# EAGLE schematic imu_68-v2 (EAGLE 9.6.2)
COMPANY: ADAFRUIT INDUSTRIES; DRAWN: KTOWN; REV: A
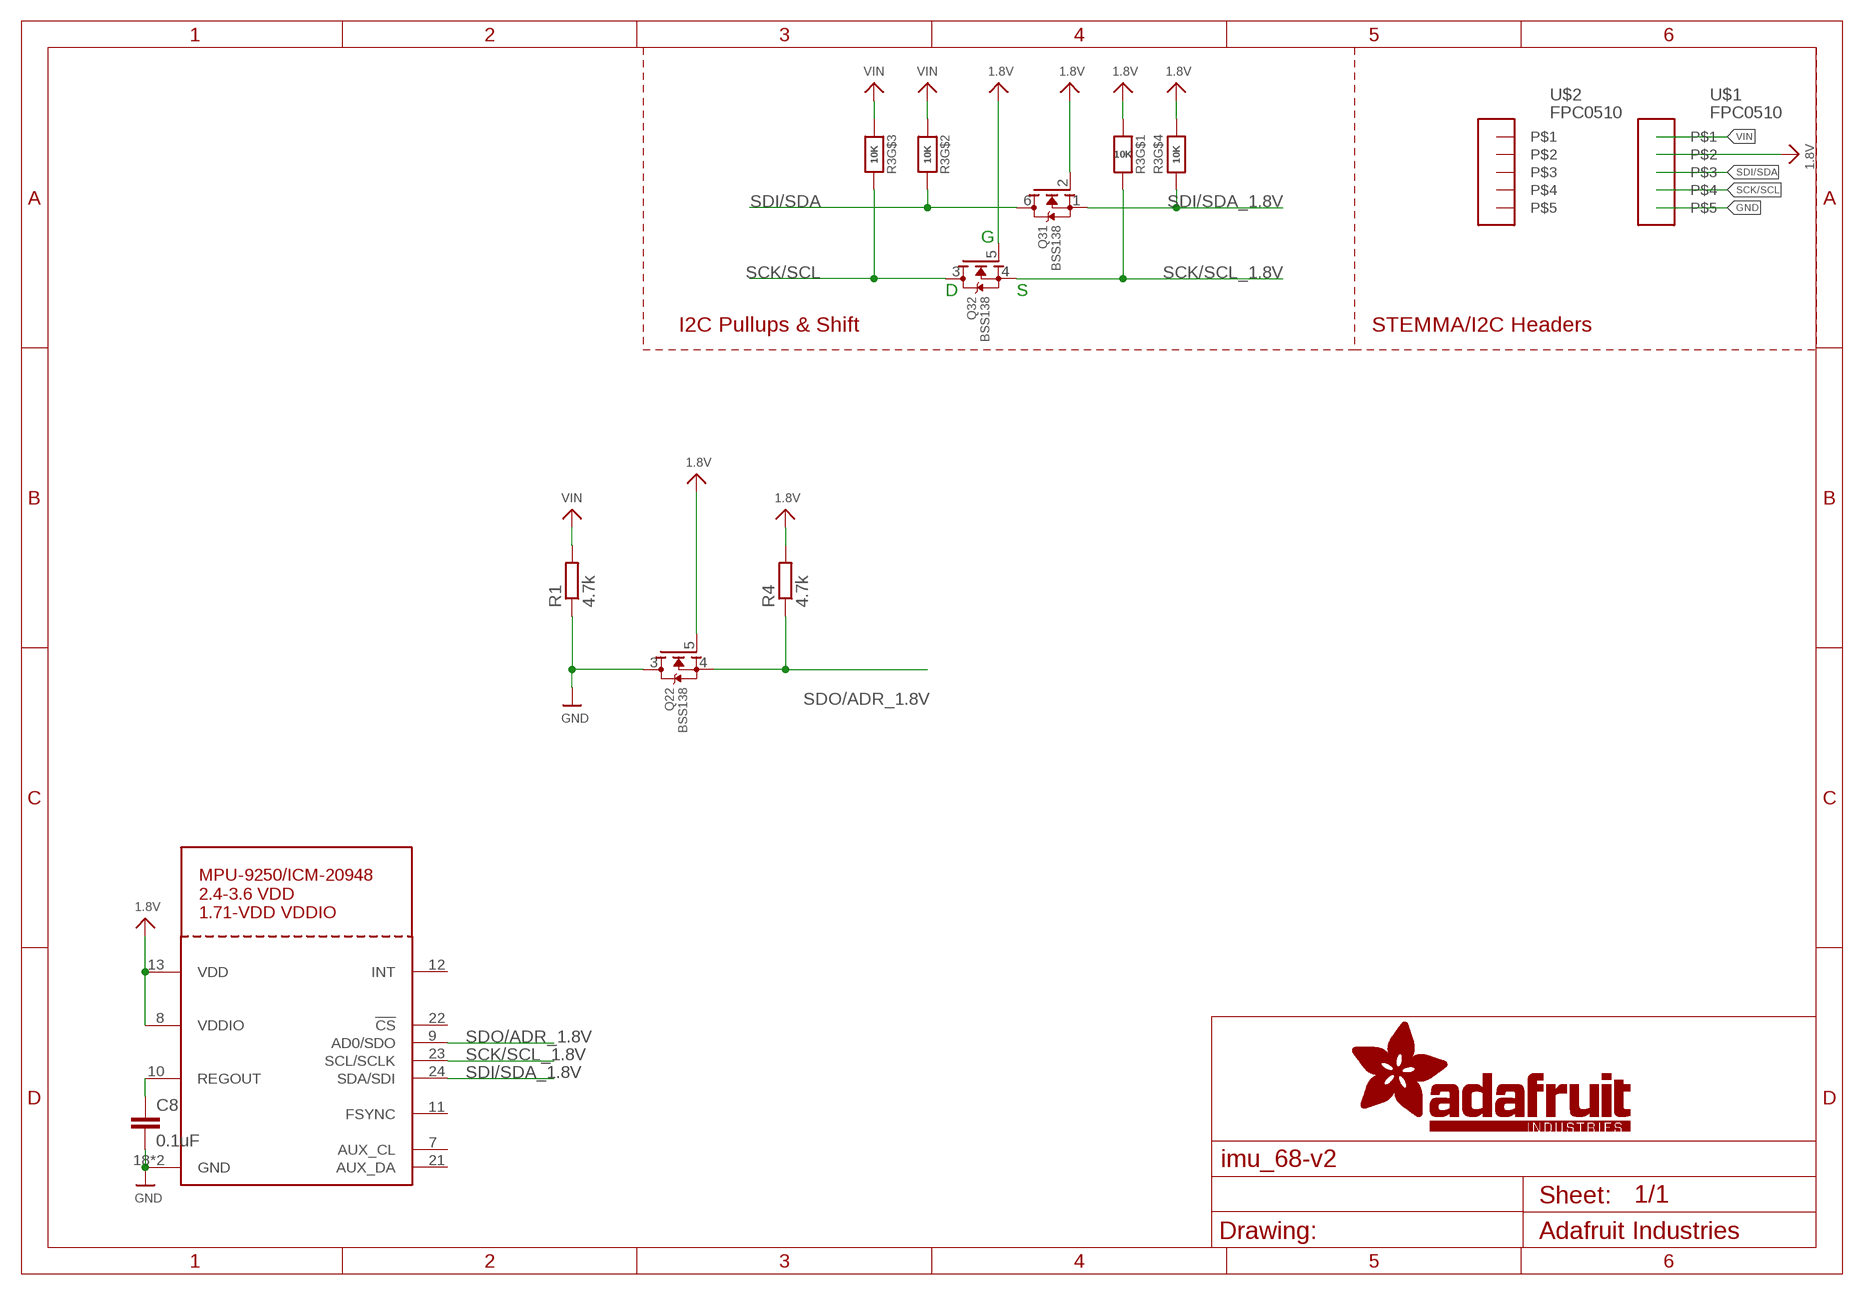
[diagram p0: schematic, sheet 1]

## Parts
C8  0.1uF  C-EUC0201  [C0201]
Q2  BSS138  MOSFET-N_DUAL  [SOT363]
Q3  BSS138  MOSFET-N_DUAL  [SOT363]
R1  4.7k  R-EU_R0402  [R0402]
R3  10K  RESISTOR_4PACK  [RESPACK_4X0603]
R4  4.7k  R-EU_R0402  [R0402]
U$1  FPC0510  [FPC0510]
U$2  FPC0510  [FPC0510]
U$21  MPU-9250_ICM20948  [QFN24_3MM_NOEP]

## Nets
1.8V: Q2.5(2:G) Q3.2(1:G) Q3.5(2:G) R3.4 R3.8 R4.2 U$1.P$2 U$21.8(VDDIO) U$21.13(VDD)
GND: C8.2 Q2.3(2:D) R1.1 U$1.P$5 U$21.18(GND) U$21.20(GND)
REGOUT: C8.1 U$21.10(REGOUT)
SCK/SCL: Q3.3(2:D) R3.6 U$1.P$4
SCK/SCL_1.8V: Q3.4(2:S) R3.1 U$21.23(SCL/SCLK)
SDI/SDA: Q3.6(1:D) R3.7 U$1.P$3
SDI/SDA_1.8V: Q3.1(1:S) R3.5 U$21.24(SDA/SDI)
SDO/ADR_1.8V: Q2.4(2:S) R4.1 U$21.9(AD0/SDO)
VIN: R1.2 R3.2 R3.3 U$1.P$1
Unconnected: Q2.1(1:S) Q2.2(1:G) Q2.6(1:D) U$2.P$1 U$2.P$2 U$2.P$3 U$2.P$4 U$2.P$5 U$21.7(AUX_CL) U$21.11(FSYNC) U$21.12(INT) U$21.21(AUX_DA) U$21.22(!CS)

## Notes on the sheet
- G
- D | S
- I2C Pullups & Shift | STEMMA/I2C Headers

## Library data of the parts
C8 = rcl:C-EU: CAPACITOR, European symbol; SPICEPREFIX: C
Q2 Q3 = microbuilder:MOSFET-N_DUAL: Dual N-Channel MOSFET SOT363 (2.0x1.25mm) 2N7002PS - 60V, 320mA [Digikey: 568-5984-1-ND]
R1 R4 = rcl:R-EU_: RESISTOR, European symbol; SPICEPREFIX: R
R3 = microbuilder:RESISTOR_4PACK: Resistor Packs (4 resistors) 4 x 0603 10K 1/16W - Digikey: YC164J-10KCT-ND
U$1 U$2 = my_library:FPC0510
U$21 = adafruit_sensor:MPU-9250: MPU-9250 3-Axis gyroscope and 3-Axis accelerometer

## Net classes
1 highpower: width 0.406 mm, drill 0.483 mm
2 lowpower: width 0.305 mm, drill 0.483 mm